# Altium schematic sheet cSLIM-SA_connectors.SchDoc: cSLIM v1 - Connectors
size A4; SheetNumber: 6; SheetTotal: 12
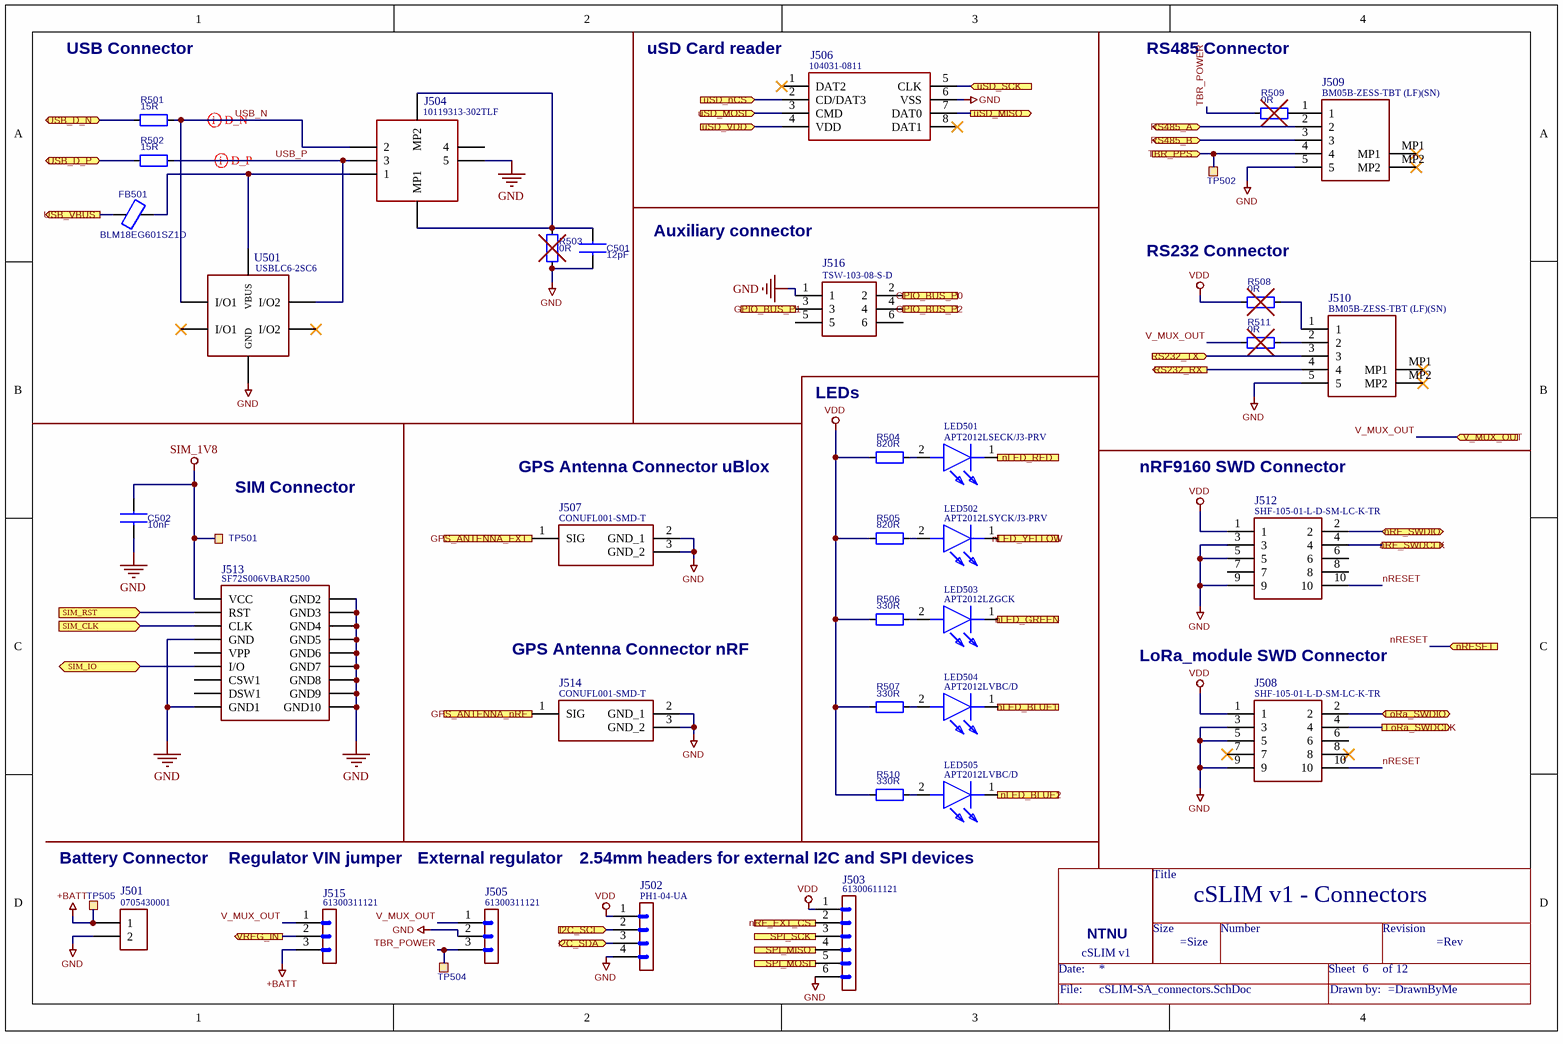
[diagram p0: cSLIM-SA_connectors.SchDoc]

## Parts
=DocumentName  Title_block  (value not drawn)  (no BOM)
C501  12pF  [CAPC1608X90N]
C502  10nF  [CAPC1608X90N]
FB501  BLM18EG601SZ1D  [CAPC1608X90N]
J501  0705430001  [SHDR2W64P0X254_1X2_737X660X1181P]
J502  PH1-04-UA  [HDRV4W64P0X254_1X4_1016X250X901P]
J503  61300611121  [HDRV6W64P0X254_1X6_1524X254X869P]
J504  10119313-302TLF  [10119313302TLF]
J505  61300311121  [HDRV3W64P0X254_1X3_762X254X869P]
J506  104031-0811  [1040310811]
J507  CONUFL001-SMD-T  [CONUFL001-SMD]
J508  SHF-105-01-L-D-SM-LC-K-TR  [SHF10501LDSMLCKTR]
J509  BM05B-ZESS-TBT (LF)(SN)  [BM05BZESSTBTLFSN]
J510  BM05B-ZESS-TBT (LF)(SN)  [BM05BZESSTBTLFSN]
J512  SHF-105-01-L-D-SM-LC-K-TR  [SHF10501LDSMLCKTR]
J513  SF72S006VBAR2500  [SF72S006VBAR2500]
J514  CONUFL001-SMD-T  [CONUFL001-SMD]
J515  61300311121  [HDRV3W64P0X254_1X3_762X254X869P]
J516  TSW-103-08-S-D  [HDRV6W64P254_2X3_762X495X838P]
LED501  APT2012LSECK/J3-PRV  [LEDC2012X75N]
LED502  APT2012LSYCK/J3-PRV  [LEDC2012X85N]
LED503  APT2012LZGCK  [LEDC2012X85N]
LED504  APT2012LVBC/D  [LEDC2012X85N]
LED505  APT2012LVBC/D  [LEDC2012X85N]
R501  15R  [RESC1608X55N]
R502  15R  [RESC1608X55N]
R503  0R  [RESC1608X55N]
R504  820R  [RESC1608X55N]
R505  820R  [RESC1608X55N]
R506  330R  [RESC1608X55N]
R507  330R  [RESC1608X55N]
R508  0R  [RESC1608X55N]
R509  0R  [RESC1608X55N]
R510  330R  [RESC1608X55N]
R511  0R  [RESC1608X55N]
TP501  TP  [TP_SMD_Ø1.0mm]  (value not drawn)  (no BOM)
TP502  TP  [TP_SMD_Ø1.0mm]  (value not drawn)  (no BOM)
TP504  TP  [TP_SMD_Ø1.0mm]  (value not drawn)  (no BOM)
TP505  TP  [TP_SMD_Ø1.0mm]  (value not drawn)  (no BOM)
U501  USBLC6-2SC6  [SOT95P280X145-6N]

## Ports
GPIO_BUS_P0 (in), GPIO_BUS_P1 (in), GPIO_BUS_P2 (in), GPS_ANTENNA_EXT (out), GPS_ANTENNA_nRF (out), I2C_SCL (in), I2C_SDA (bidir), LoRa_SWDCLK (out), LoRa_SWDIO (bidir), nLED_BLUE1 (in), nLED_BLUE2 (in), nLED_GREEN (in), nLED_RED (in), nLED_YELLOW (in), nRESET (in), nRF_EXT_CS (in), nRF_SWDCLK (out), nRF_SWDIO (bidir), RS232_RX (out), RS232_TX (in), RS485_A (bidir), RS485_B (bidir), SIM_CLK (in), SIM_IO (bidir), SIM_RST (in), SPI_MISO (out), SPI_MOSI (in), SPI_SCK (in), TBR_PPS (in), USB_D_N (bidir), USB_D_P (bidir), USB_VBUS (out), uSD_MISO (out), uSD_MOSI (in), uSD_nCS (in), uSD_SCK (in), uSD_VDD (in), V_MUX_OUT (in), VREG_IN (out)

## Nets
+BATT: J501.1 J515.3 TP505.1
GND: C501.2 C502.2 J501.2 J502.4 J503.6 J504.5 J505.2 J506.6(VSS) J507.2(GND_1) J507.3(GND_2) J508.3 J508.5 J508.9 J509.5 J510.5 J512.3 J512.5 J512.9 J513.C5(GND) J513.GND1 J513.GND2 J513.GND3 J513.GND4 J513.GND5 J513.GND6 J513.GND7 J513.GND8 J513.GND9 J513.GND10 J514.2(GND_1) J514.3(GND_2) J516.1 R503.2 U501.2(GND)
SIM_1V8: C502.1 J513.C1(VCC) TP501.1
VDD: J502.1 J503.1 J508.1 J512.1 R504.2 R505.2 R506.2 R507.2 R508.2 R510.2
GPIO_BUS_P0: J516.2 ; port GPIO_BUS_P0
GPIO_BUS_P1: J516.3 ; port GPIO_BUS_P1
GPIO_BUS_P2: J516.4 ; port GPIO_BUS_P2
GPS_ANTENNA_EXT: J507.1(SIG) ; port GPS_ANTENNA_EXT
GPS_ANTENNA_nRF: J514.1(SIG) ; port GPS_ANTENNA_nRF
I2C_SCL: J502.2 ; port I2C_SCL
I2C_SDA: J502.3 ; port I2C_SDA
LoRa_SWDCLK: J508.4 ; port LoRa_SWDCLK
LoRa_SWDIO: J508.2 ; port LoRa_SWDIO
nLED_BLUE1: LED504.1(K) ; port nLED_BLUE1
nLED_BLUE2: LED505.1(K) ; port nLED_BLUE2
nLED_GREEN: LED503.1(K) ; port nLED_GREEN
nLED_RED: LED501.1(K) ; port nLED_RED
nLED_YELLOW: LED502.1(K) ; port nLED_YELLOW
nRESET: J508.10 J512.10 ; port nRESET
nRF_EXT_CS: J503.2 ; port nRF_EXT_CS
nRF_SWDCLK: J512.4 ; port nRF_SWDCLK
nRF_SWDIO: J512.2 ; port nRF_SWDIO
RS232_RX: J510.4 ; port RS232_RX
RS232_TX: J510.3 ; port RS232_TX
RS485_A: J509.2 ; port RS485_A
RS485_B: J509.3 ; port RS485_B
SIM_CLK: J513.C3(CLK) ; port SIM_CLK
SIM_IO: J513.C7(I/O) ; port SIM_IO
SIM_RST: J513.C2(RST) ; port SIM_RST
SPI_MISO: J503.4 ; port SPI_MISO
SPI_MOSI: J503.5 ; port SPI_MOSI
SPI_SCK: J503.3 ; port SPI_SCK
TBR_POWER: J505.3 R509.2 TP504.1
TBR_PPS: J509.4 TP502.1 ; port TBR_PPS
USB_D_N: R501.2 ; port USB_D_N
USB_D_P: R502.2 ; port USB_D_P
USB_N: J504.2 R501.1 U501.6(I/O1)
USB_P: J504.3 R502.1 U501.4(I/O2)
USB_VBUS: FB501.1 ; port USB_VBUS
uSD_MISO: J506.7(DAT0) ; port uSD_MISO
uSD_MOSI: J506.3(CMD) ; port uSD_MOSI
uSD_nCS: J506.2(CD/DAT3) ; port uSD_nCS
uSD_SCK: J506.5(CLK) ; port uSD_SCK
uSD_VDD: J506.4(VDD) ; port uSD_VDD
V_MUX_OUT: J505.1 J515.1 R511.2 ; port V_MUX_OUT
VREG_IN: J515.2 ; port VREG_IN
NetC501_1: C501.1 J504.MP1 J504.MP2 R503.1
NetFB501_2: FB501.2 J504.1 U501.5(VBUS)
NetJ509_1: J509.1 R509.1
NetJ510_1: J510.1 R508.1
NetJ510_2: J510.2 R511.1
NetLED501_2: LED501.2(A) R504.1
NetLED502_2: LED502.2(A) R505.1
NetLED503_2: LED503.2(A) R506.1
NetLED504_2: LED504.2(A) R507.1
NetLED505_2: LED505.2(A) R510.1

Not connected (* = marked no-connect by the designer): J504 4; J506 1(DAT2)* 8(DAT1)*; J508 6 7* 8*; J509 MP1* MP2*; J510 MP1* MP2*; J512 6 7 8; J513 C6(VPP) CSW1 DSW1; J516 5 6; U501 1(I/O1)* 3(I/O2)*

## Layout directives
differential pair: USB_N, USB_P

## Notes on the sheet
- USB Connector
- (near J506) uSD Card reader
- RS485 Connector
- Auxiliary connector
- (near R508) RS232 Connector
- LEDs
- (near TP501) SIM Connector
- GPS Antenna Connector uBlox
- nRF9160 SWD Connector
- GPS Antenna Connector nRF
- LoRa_module SWD Connector
- Battery Connector
- Regulator VIN jumper
- External regulator
- 2.54mm headers for external I2C and SPI devices
- 1
- 2
- 3
- 4
- 5
- 6
- A
- B
- C
- Eivind Jølsgard
- D
- Title: cSLIM Connectors
- File: cSLIM_connectors.sch
- Sheet: /
- NTNU
- KiCad E.D.A.  kicad (5.1.4)-1
- Size: A4
- Date: 2021-03-31
- Rev: v1
- Id: 5/11
- (in symbol Title_block) Title; Size; Number; Revision; NTNU; cSLIM v1; Date:; Sheet; of; File:; Drawn by:

## Library data of the parts
C501 = C: Capacitor; Manufacturer_Part_Number: 0603N120J500CT; Fitted: Yes; value: 12pF
C502 = C: Capacitor; Manufacturer_Part_Number: CL10B103KB8NNNC; Fitted: Yes; value: 10nF
FB501 = Ferrite_Bead: Ferrite bead; value: 500 mA, 600 Ohms; Manufacturer_Part_Number: BLM18EG601SZ1D
J501 = 70543-0001: BAT CONN HEADER VERT 2POS 2.54MM; Manufacturer_Name: Molex; Fitted: Yes; Datasheet Link: http://www.molex.com/pdm_docs/sd/705430001_sd.pdf; Height: 11.81mm; Manufacturer_Part_Number: 70543-0001; Mouser Part Number: 538-70543-0001; Mouser Price/Stock: https://www.mouser.co.uk/ProductDetail/Molex/70543-0001?qs=tYx%252BZc2nXqpCsE0XoulATg%3D%3D
J502 = PH1-04-UA: CONN HEADER VERT 4POS 2.54MM; Manufacturer_Name: Adam Tech; Fitted: Yes; Datasheet Link: https://datasheet.datasheetarchive.com/originals/distributors/Datasheets_SAMA/22522227e000bb8d8f26a3580c1bb98b.pdf; Height: 9.008mm; Manufacturer_Part_Number: PH1-04-UA; Arrow Part Number: PH1-04-UA; Arrow Price/Stock: https://www.arrow.com/en/products/ph1-04-ua/adam-tech
J503 = 61300611121: CONN HEADER VERT 6POS 2.54MM; Manufacturer_Name: Wurth Elektronik; Fitted: Yes; Datasheet Link: https://componentsearchengine.com/Datasheets/2/61300611121.pdf; Height: 8.69mm; Manufacturer_Part_Number: 61300611121; Mouser Part Number: 710-61300611121; Mouser Price/Stock: https://www.mouser.co.uk/ProductDetail/Wurth-Elektronik/61300611121?qs=t4813l51qx%2FRpdf0Kp1HlQ%3D%3D
J504 = 10119313-302TLF: USB - mini B USB 2.0 Receptacle Connector 5 Position Through Hole; Manufacturer_Name: Amphenol; Fitted: Yes; Datasheet Link: https://www.arrow.com/en/products/10119313-302tlf/amphenol-fci; Height: 9.55mm; Manufacturer_Part_Number: 10119313-302TLF; Mouser Part Number: 649-10119313-302TLF; Mouser Price/Stock: https://www.mouser.co.uk/ProductDetail/Amphenol-FCI/10119313-302TLF?qs=QcFhgjUTvvpTzLjwlVEXAA%3D%3D; Arrow Part Number: 10119313-302TLF; Arrow Price/Stock: https://www.arrow.com/en/products/10119313-302tlf/amphenol-fci
J505 J515 = 61300311121: CONN HEADER VERT 3POS 2.54MM; Manufacturer_Name: Wurth Elektronik; Fitted: Yes; Datasheet Link: http://katalog.we-online.de/em/datasheet/6130xx11121.pdf; Height: 8.69mm; Manufacturer_Part_Number: 61300311121; Mouser Part Number: 710-61300311121; Mouser Price/Stock: https://www.mouser.co.uk/ProductDetail/Wurth-Elektronik/61300311121?qs=PhR8RmCirEYxRWFJzNKsUw%3D%3D
J506 = 104031-0811: CONN MICRO SD CARD PUSH-PULL R/A; Manufacturer_Name: Molex; Fitted: Yes; Datasheet Link: http://www.molex.com/webdocs/datasheets/pdf/en-us/1040310811_MEMORY_CARD_SOCKET.pdf; Manufacturer_Part_Number: 104031-0811; Mouser Part Number: 538-104031-0811; Mouser Price/Stock: https://www.mouser.co.uk/ProductDetail/Molex/104031-0811?qs=udsGRKD4nA3Tvy7wqky%252BuA%3D%3D
J507 J514 = CONUFL001-SMD-T: CONN UMC JACK STR SMD; Manufacturer_Name: Linx Technologies; Fitted: Yes; Datasheet Link: https://linxtechnologies.com/wp/product/mhf-rf-connectors/; Manufacturer_Part_Number: CONUFL001-SMD-T; Mouser Part Number: 712-CONUFL001-SMD-T; Mouser Price/Stock: https://www.mouser.co.uk/ProductDetail/Linx-Technologies/CONUFL001-SMD-T?qs=EU6FO9ffTwfRdkBeQTdJWQ%3D%3D
J508 J512 = SHF-105-01-L-D-SM-LC-K-TR: CONN HEADER SMD 10POS 1.27MM; Manufacturer_Name: Samtech; Fitted: Yes; Datasheet Link: https://suddendocs.samtec.com/prints/shf-1xx-01-x-d-xx-xx-xx-mkt.pdf; Height: 5.33mm; Manufacturer_Part_Number: SHF-105-01-L-D-SM-LC-K-TR
J509 J510 = BM05B-ZESS-TBT__LF__SN_: RS232/RS485  CONN HEADER SMD 5POS 1.5MM; Manufacturer_Name: JST (JAPAN SOLDERLESS TERMINALS); Fitted: Yes; Datasheet Link: https://www.arrow.com/en/products/bm05b-zess-tbt-lf-sn/jst-manufacturing; Height: 7.5mm; Manufacturer_Part_Number: BM05B-ZESS-TBT (LF)(SN); Arrow Part Number: BM05B-ZESS-TBT (LF)(SN); Arrow Price/Stock: https://www.arrow.com/en/products/bm05b-zess-tbt-lf-sn/jst-manufacturing
J513 = SF72S006VBAR2500: NANO SIM CARD PUSH-PUSH; Manufacturer_Name: JAE Electronics; Fitted: Yes; Datasheet Link: https://componentsearchengine.com/Datasheets/1/SF72S006VBAR2500.pdf; Height: 1.25mm; Manufacturer_Part_Number: SF72S006VBAR2500; Mouser Part Number: 656-SF72S006VBAR2500; Mouser Price/Stock: https://www.mouser.co.uk/ProductDetail/JAE-Electronics/SF72S006VBAR2500?qs=zwT864VV%2FINpxlkc4yTPCw%3D%3D
J516 = TSW-103-08-S-D: Auxillary 2x3 conn; Manufacturer_Name: SAMTEC; Fitted: Yes; Datasheet Link: http://suddendocs.samtec.com/catalog_english/tsw_th.pdf; Height: 8.38mm; Manufacturer_Part_Number: TSW-103-08-S-D; Mouser Part Number: 200-TSW10308SD; Mouser Price/Stock: https://www.mouser.co.uk/ProductDetail/Samtec/TSW-103-08-S-D?qs=rU5fayqh%252BE0V5%2FEE8QdeZQ%3D%3D; Arrow Part Number: TSW-103-08-S-D; Arrow Price/Stock: https://www.arrow.com/en/products/tsw-103-08-s-d/samtec
LED501 = APT2012LSECK_J3-PRV: LED RED CLEAR 2SMD; Manufacturer_Name: Kingbright; Fitted: Yes; Datasheet Link: http://www.kingbrightusa.com/images/catalog/SPEC/APT2012LSECK-J3-PRV.pdf; Height: 0.75mm; Manufacturer_Part_Number: APT2012LSECK/J3-PRV; Mouser Part Number: 604-APT2012LSECKJ3RV; Mouser Price/Stock: https://www.mouser.co.uk/ProductDetail/Kingbright/APT2012LSECK-J3-PRV?qs=6oMev5NRZMEkGJkKIsAalQ%3D%3D; Arrow Part Number: APT2012LSECK/J3-PRV; Arrow Price/Stock: https://www.arrow.com/en/products/apt2012lseckj3-prv/kingbright
LED502 = APT2012LSYCK_J3-PRV: LED YELLOW CLEAR 2SMD; Manufacturer_Name: Kingbright; Fitted: Yes; Datasheet Link: http://www.kingbrightusa.com/images/catalog/SPEC/APT2012LSYCK-J3-PRV.pdf; Height: 0.85mm; Manufacturer_Part_Number: APT2012LSYCK/J3-PRV; Mouser Part Number: 604-APT2012LSYCKJ3RV; Mouser Price/Stock: https://www.mouser.co.uk/ProductDetail/Kingbright/APT2012LSYCK-J3-PRV?qs=6oMev5NRZMGoWLCc4feqUg%3D%3D; Arrow Part Number: APT2012LSYCK/J3-PRV; Arrow Price/Stock: https://www.arrow.com/en/products/apt2012lsyckj3-prv/kingbright
LED503 = APT2012LZGCK: LED GREEN CLEAR 2SMD; Manufacturer_Name: Kingbright; Fitted: Yes; Datasheet Link: http://www.kingbrightusa.com/images/catalog/SPEC/APT2012LZGCK.pdf; Height: 0.85mm; Manufacturer_Part_Number: APT2012LZGCK; Mouser Part Number: 604-APT2012LZGCK; Mouser Price/Stock: https://www.mouser.co.uk/ProductDetail/Kingbright/APT2012LZGCK?qs=6oMev5NRZMHOosFiXb%2F3qw%3D%3D; Arrow Part Number: APT2012LZGCK; Arrow Price/Stock: https://www.arrow.com/en/products/apt2012lzgck/kingbright
LED504 LED505 = APT2012LVBC_D: LED BLUE CLEAR 2SMD; Manufacturer_Name: Kingbright; Fitted: Yes; Datasheet Link: https://componentsearchengine.com/Datasheets/1/APT2012LVBC_D.pdf; Height: 0.85mm; Manufacturer_Part_Number: APT2012LVBC/D; Mouser Part Number: 604-APT2012LVBCD; Mouser Price/Stock: https://www.mouser.co.uk/ProductDetail/Kingbright/APT2012LVBC-D?qs=6oMev5NRZMGErJYT6KZLXg%3D%3D; Arrow Part Number: APT2012LVBC/D; Arrow Price/Stock: https://www.arrow.com/en/products/apt2012lvbcd/kingbright
R501 R502 = R: Manufacturer_Part_Number: RC0603JR-0715RL; Fitted: Yes; value: 15R
R503 R508 R509 R511 = R: Manufacturer_Part_Number: YJP1608-R001; Fitted: No; value: 0R
R504 R505 = R: Manufacturer_Part_Number: RC0603FR-07820RL; Fitted: Yes; value: 820R
R506 R507 R510 = R: Manufacturer_Part_Number: RC0603FR-07330RL; Fitted: Yes; value: 330R
TP501 TP502 TP504 TP505 = TP: Test points
U501 = USBLC6-2SC6: 17V Clamp 5A (8/20µs) Ipp Tvs Diode Surface Mount SOT-23-6; Manufacturer_Name: STMicroelectronics; Fitted: Yes; Datasheet Link: http://www.st.com/st-web-ui/static/active/en/resource/technical/document/datasheet/CD00050750.pdf; Height: 1.45mm; Manufacturer_Part_Number: USBLC6-2SC6; Mouser Part Number: 511-USBLC6-2SC6; Mouser Price/Stock: https://www.mouser.co.uk/ProductDetail/STMicroelectronics/USBLC6-2SC6?qs=po45yt2pPpu%2FhNIlwQdTlg%3D%3D; Arrow Part Number: USBLC6-2SC6; Arrow Price/Stock: https://www.arrow.com/en/products/usblc6-2sc6/stmicroelectronics?region=nac